# EAGLE design shieldAtmegaArianna_00 (EAGLE 6.5.0)
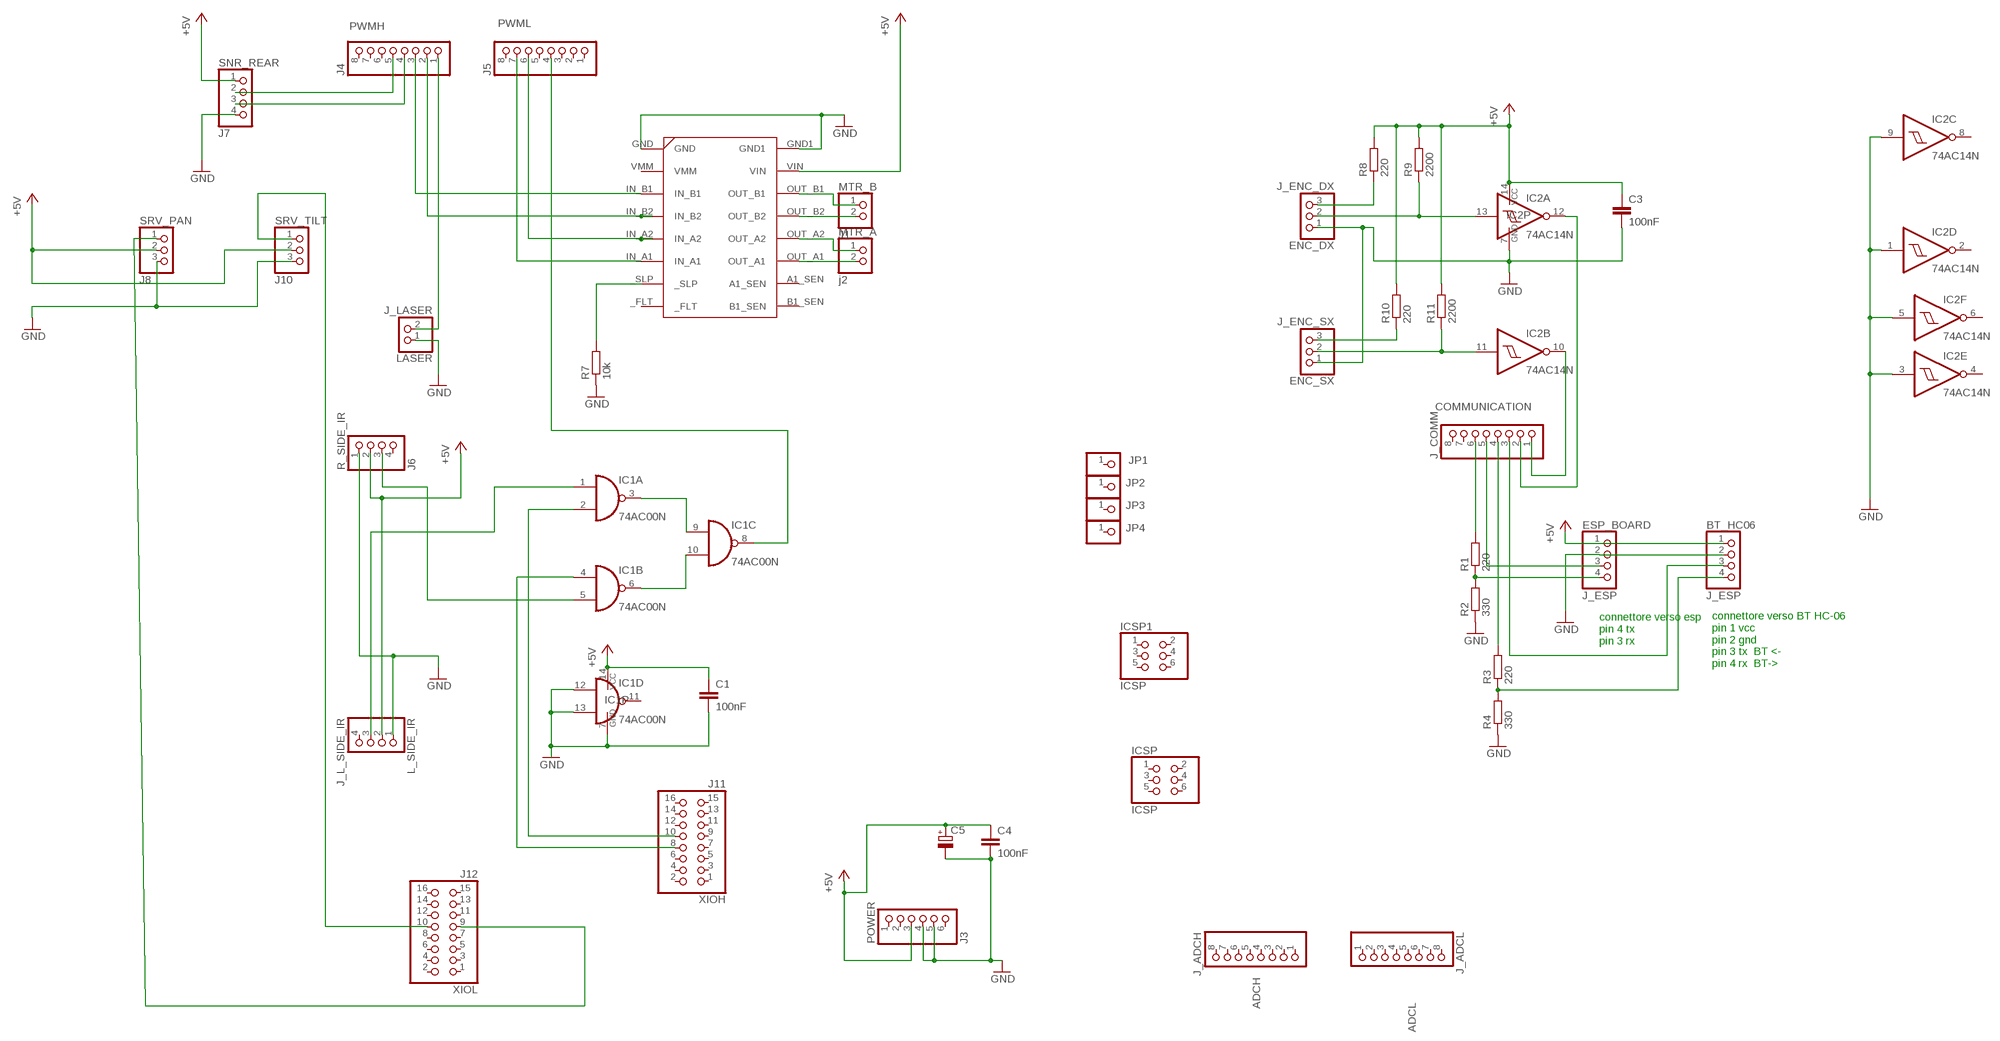
[diagram p0: schematic, sheet 1]

## Parts
ADCH  J_ADCH  PINHD-1X8  [1X08]
ADCL  J_ADCL  PINHD-1X8  [1X08]
BT_HC06  J_ESP  PINHD-1X4  [1X04]
C1  100nF  C-EU050-025X075  [C050-025X075]
C3  100nF  C-EU050-025X075  [C050-025X075]
C4  100nF  C-EU050-025X075  [C050-025X075]
C5  CPOL-EUE5-8.5  [E5-8,5]
COMMUNICATION  J_COMM  PINHD-1X8  [1X08]
ENC_DX  J_ENC_DX  PINHD-1X3  [1X03]
ENC_SX  J_ENC_SX  PINHD-1X3  [1X03]
ESP_BOARD  J_ESP  PINHD-1X4  [1X04]
IC1  74AC00N  [DIL14]
IC2  74AC14N  [DIL14]
ICSP  ICSP  PINHD-2X3  [2X03]
ICSP1  ICSP  PINHD-2X3  [2X03]
JP1  PINHD-1X1  [1X01]
JP2  PINHD-1X1  [1X01]
JP3  PINHD-1X1  [1X01]
JP4  PINHD-1X1  [1X01]
L_SIDE_IR  J_L_SIDE_IR  PINHD-1X4  [1X04]
LASER  J_LASER  PINHD-1X2  [1X02]
MTR_A  j2  PINHD-1X2  [1X02]
MTR_B  J1  PINHD-1X2  [1X02]
POWER  J3  PINHD-1X6  [1X06]
PWMH  J4  PINHD-1X8  [1X08]
PWML  J5  PINHD-1X8  [1X08]
R1  220  R-EU_0207/10  [0207/10]
R2  330  R-EU_0207/10  [0207/10]
R3  220  R-EU_0207/10  [0207/10]
R4  330  R-EU_0207/10  [0207/10]
R7  10k  R-EU_0207/10  [0207/10]
R8  220  R-EU_0207/10  [0207/10]
R9  2200  R-EU_0207/10  [0207/10]
R10  220  R-EU_0207/10  [0207/10]
R11  2200  R-EU_0207/10  [0207/10]
R_SIDE_IR  J6  PINHD-1X4  [1X04]
SNR_REAR  J7  PINHD-1X4  [1X04]
SRV_PAN  J8  PINHD-1X3  [1X03]
SRV_TILT  J10  PINHD-1X3  [1X03]
U$1  DRV8803  [8X5CARRIER]
XIOH  J11  PINHD-2X8  [2X08]
XIOL  J12  PINHD-2X8  [2X08]

## Nets
+5V [supply]: BT_HC06.1 C1.1 C3.1 C4.1 C5.+ ESP_BOARD.1 IC1.14(P:VCC) IC2.14(P:VCC) L_SIDE_IR.2 POWER.3 R8.2 R9.2 R10.2 R11.2 R_SIDE_IR.2 SNR_REAR.1 SRV_PAN.2 SRV_TILT.2 U$1.VIN
ECHO: PWMH.4 SNR_REAR.3
GND: BT_HC06.2 C1.2 C3.2 C4.2 C5.- ENC_DX.1 ENC_SX.1 ESP_BOARD.2 IC1.7(P:GND) IC1.12(D:I0) IC1.13(D:I1) IC2.1(D:I) IC2.3(E:I) IC2.5(F:I) IC2.7(P:GND) IC2.9(C:I) L_SIDE_IR.1 LASER.1 POWER.4 POWER.5 R2.1 R4.1 R7.1 R_SIDE_IR.1 SNR_REAR.4 SRV_PAN.3 SRV_TILT.3 U$1.GND U$1.GND1
N$1 [supply]: MTR_B.1 U$1.OUT_B1
N$2 [supply]: MTR_B.2 U$1.OUT_B2
N$3 [supply]: MTR_A.1 U$1.OUT_A2
N$4: SRV_TILT.1 XIOL.10
N$5: SRV_PAN.1 XIOL.9
N$6 [supply]: MTR_A.2 U$1.OUT_A1
N$7: PWML.7 U$1.IN_A1
N$8: PWML.6 U$1.IN_A2
N$9: PWMH.2 U$1.IN_B2
N$10: PWMH.3 U$1.IN_B1
N$11: ESP_BOARD.4 R1.1 R2.2
N$12: BT_HC06.4 R3.1 R4.2
N$14: COMMUNICATION.6 R1.2
N$15: COMMUNICATION.4 R3.2
N$16: COMMUNICATION.5 ESP_BOARD.3
N$17: BT_HC06.3 COMMUNICATION.3
N$19: IC1.3(A:O) IC1.9(C:I0)
N$20: IC1.6(B:O) IC1.10(C:I1)
N$21 [supply]: LASER.2 PWMH.1
N$22: IC1.2(A:I1) XIOH.10
N$23: IC1.5(B:I1) R_SIDE_IR.3
N$24: IC1.8(C:O) PWML.4
N$25: IC1.1(A:I0) L_SIDE_IR.3
N$26: IC1.4(B:I0) XIOH.8
N$27: R7.2 U$1._SLP
N$28: ENC_DX.3 R8.1
N$29: ENC_DX.2 IC2.13(A:I) R9.1
N$30: ENC_SX.3 R10.1
N$31: PWMH.5 SNR_REAR.2
N$32: ENC_SX.2 IC2.11(B:I) R11.1
N$33: COMMUNICATION.2 IC2.12(A:O)
N$35: COMMUNICATION.1 IC2.10(B:O)
Unconnected: ADCH.1 ADCH.2 ADCH.3 ADCH.4 ADCH.5 ADCH.6 ADCH.7 ADCH.8 ADCL.1 ADCL.2 ADCL.3 ADCL.4 ADCL.5 ADCL.6 ADCL.7 ADCL.8 COMMUNICATION.7 COMMUNICATION.8 IC1.11(D:O) IC2.2(D:O) IC2.4(E:O) IC2.6(F:O) IC2.8(C:O) ICSP1.1 ICSP1.2 ICSP1.3 ICSP1.4 ICSP1.5 ICSP1.6 ICSP.1 ICSP.2 ICSP.3 ICSP.4 ICSP.5 ICSP.6 JP1.1 JP2.1 JP3.1 JP4.1 L_SIDE_IR.4 POWER.1 POWER.2 POWER.6 PWMH.6 PWMH.7 PWMH.8 PWML.1 PWML.2 PWML.3 PWML.5 PWML.8 R_SIDE_IR.4 U$1._FLT U$1.A1_SEN U$1.B1_SEN U$1.VMM XIOH.1 XIOH.2 XIOH.3 XIOH.4 XIOH.5 XIOH.6 XIOH.7 XIOH.9 XIOH.11 XIOH.12 XIOH.13 XIOH.14 XIOH.15 XIOH.16 XIOL.1 XIOL.2 XIOL.3 XIOL.4 XIOL.5 XIOL.6 XIOL.7 XIOL.8 XIOL.11 XIOL.12 XIOL.13 XIOL.14 XIOL.15 XIOL.16

## Notes on the sheet
- connettore verso esp 
  pin 4 tx
  pin 3 rx
- connettore verso BT HC-06
  pin 1 vcc
  pin 2 gnd
  pin 3 tx  BT <-
  pin 4 rx  BT->

## Library data of the parts
ADCH ADCL COMMUNICATION PWMH PWML = pinhead:PINHD-1X8: PIN HEADER
BT_HC06 ESP_BOARD L_SIDE_IR R_SIDE_IR SNR_REAR = pinhead:PINHD-1X4: PIN HEADER
C1 C3 C4 = rcl:C-EU: CAPACITOR, European symbol
C5 = rcl:CPOL-EU: POLARIZED CAPACITOR, European symbol
ENC_DX ENC_SX SRV_PAN SRV_TILT = pinhead:PINHD-1X3: PIN HEADER
IC1 = 74xx-eu:74*00: Quad 2-input NAND gate
IC2 = 74xx-eu:74*14: Hex schmitt trigger INVERTER
ICSP ICSP1 = pinhead:PINHD-2X3: PIN HEADER
JP1-JP4 = pinhead:PINHD-1X1: PIN HEADER
LASER MTR_A MTR_B = pinhead:PINHD-1X2: PIN HEADER
POWER = pinhead:PINHD-1X6: PIN HEADER
R1-R4 R7-R11 = rcl:R-EU_: RESISTOR, European symbol
U$1 = arianna:DRV8803
XIOH XIOL = pinhead:PINHD-2X8: PIN HEADER

## Net classes
0 default: width 0.152 mm, drill 0.305 mm, clearance 0.152 mm
1 supply: width 0.61 mm, drill 0.305 mm, clearance 0.152 mm to class 0, clearance 0.152 mm

## Board
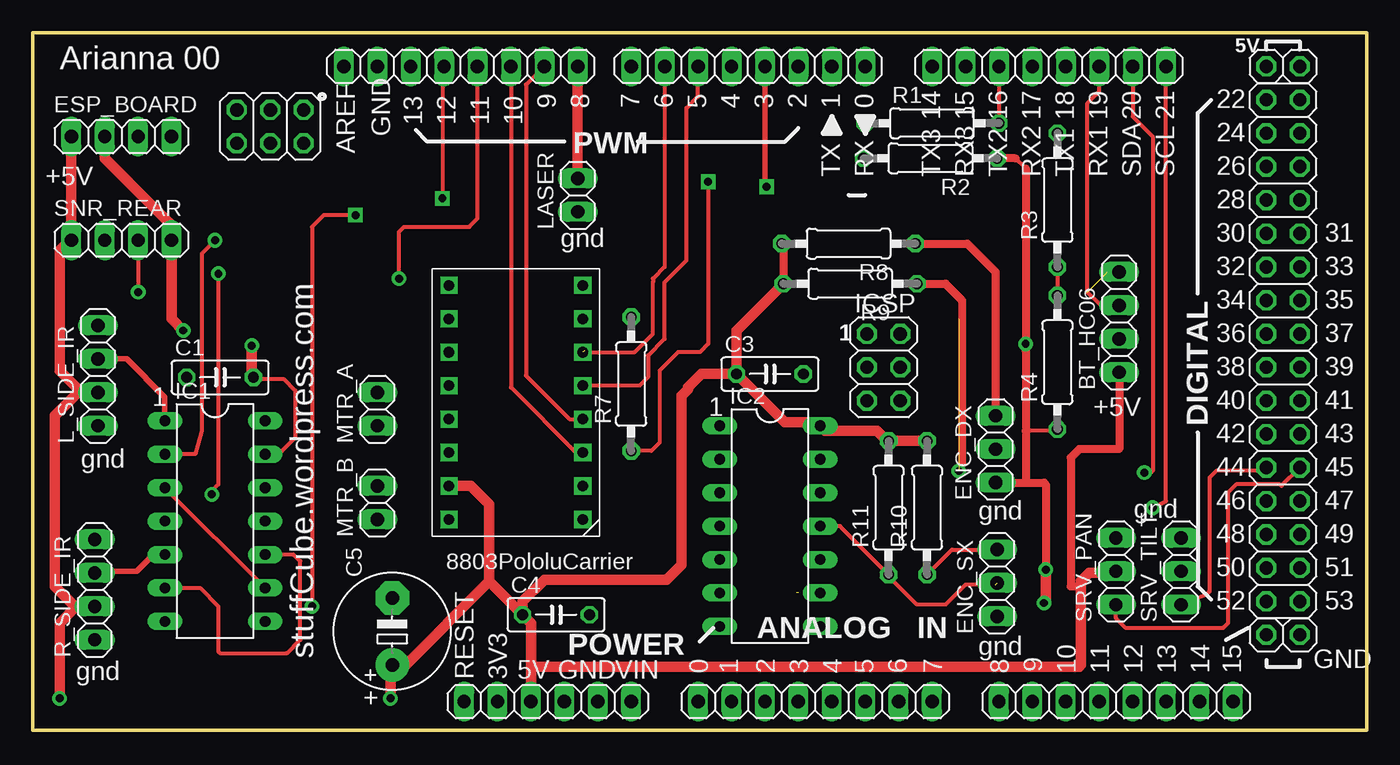
[diagram p1: board, top side]
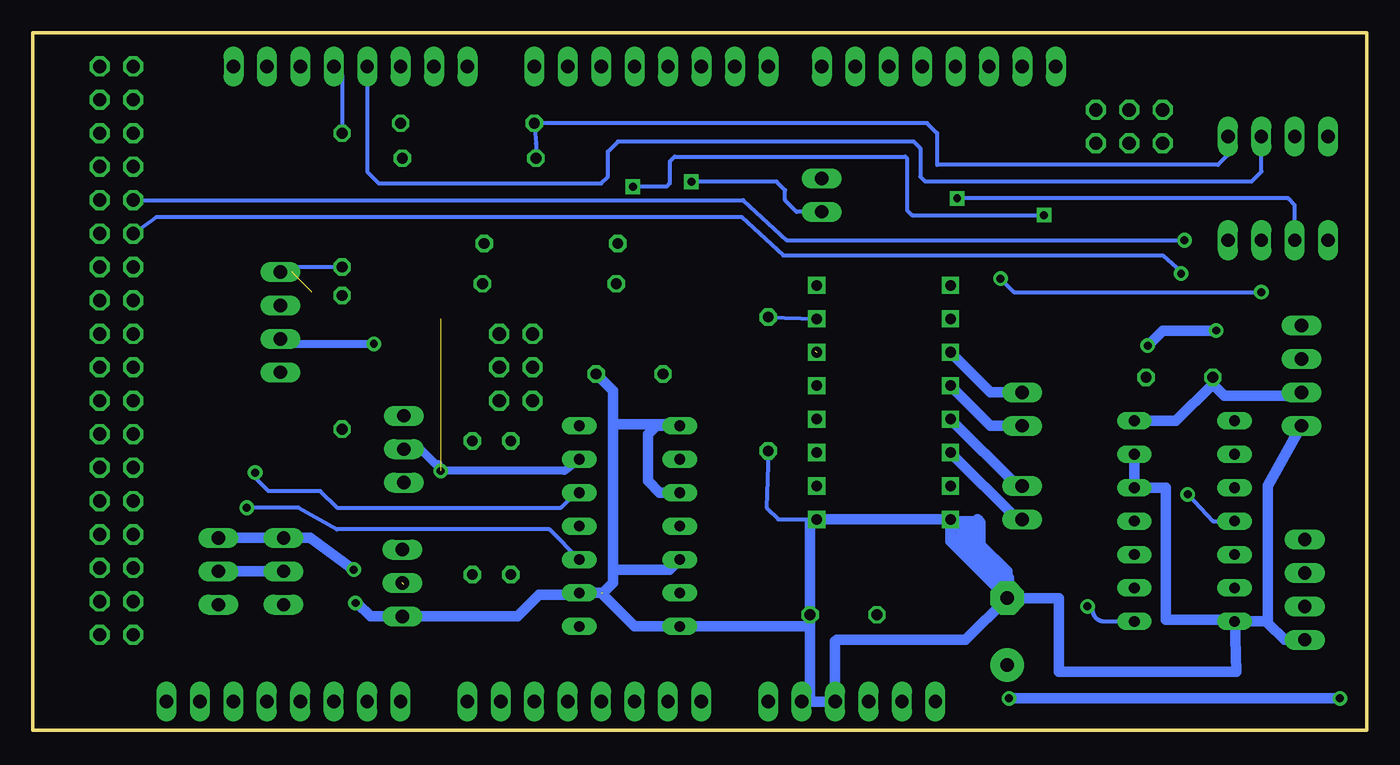
[diagram p2: board, bottom side, seen from below]

Size 101.35 x 52.96 mm. Coordinates in mm from the lower left corner, seen from the top.
Outline: 0,52.96 101.35,52.96 101.35,0 0,0 0,52.96
Copper layers (1*16): Top 0.035mm / dielectric 1.5mm / Bottom 0.035mm
Design rules "default": minimum track width 6mil, minimum drill 12mil, track to track 6mil, track to pad 6mil, pad to pad 6mil, via to via 6mil, smd to smd 6mil, copper to edge 40mil, drill to drill 12mil, minimum pad ring 10mil, minimum via ring 10mil, stop-mask expansion 2mil, vias tented up to drill 1mil, thermal gap 10mil

### Footprints (pad centres in the part's own frame; a part is rotated, then mirrored left to right if it is on the bottom)
1X08 = drill 1.016 long: 1 -8.89,0; 2 -6.35,0; 3 -3.81,0; 4 -1.27,0; 5 1.27,0; 6 3.81,0; 7 6.35,0; 8 8.89,0
1X04 = drill 1.016 long: 1 -3.81,0; 2 -1.27,0; 3 1.27,0; 4 3.81,0
C050-025X075 = drill 0.813 octagon: 1 -2.54,0; 2 2.54,0
E5-8,5 = drill 1.016 pad 2.54: + -2.54,0 | drill 1.016 pad 2.54 octagon: - 2.54,0
1X03 = drill 1.016 long: 1 -2.54,0; 2 0,0; 3 2.54,0
DIL14 = drill 0.813 long: 1 -7.62,-3.81; 2 -5.08,-3.81; 3 -2.54,-3.81; 4 0,-3.81; 5 2.54,-3.81; 6 5.08,-3.81; 7 7.62,-3.81; 8 7.62,3.81; 9 5.08,3.81; 10 2.54,3.81; 11 0,3.81; 12 -2.54,3.81; 13 -5.08,3.81; 14 -7.62,3.81
2X03 = drill 1.016 octagon: 1 -2.54,-1.27; 2 -2.54,1.27; 3 0,-1.27; 4 0,1.27; 5 2.54,-1.27; 6 2.54,1.27
1X01 = drill 1.016 octagon: 1 0,0
1X02 = drill 1.016 long: 1 -1.27,0; 2 1.27,0
1X06 = drill 1.016 long: 1 -6.35,0; 2 -3.81,0; 3 -1.27,0; 4 1.27,0; 5 3.81,0; 6 6.35,0
0207/10 = drill 0.813 octagon: 1 -5.08,0; 2 5.08,0
8X5CARRIER = drill 0.8 square: _FLT -5.08,-8.89; _SLP -5.08,-6.35; A1_SEN 5.08,-6.35; B1_SEN 5.08,-8.89; GND -5.08,8.89; GND1 5.08,8.89; IN_A1 -5.08,-3.81; IN_A2 -5.08,-1.27; IN_B1 -5.08,3.81; IN_B2 -5.08,1.27; OUT_A1 5.08,-3.81; OUT_A2 5.08,-1.27; OUT_B1 5.08,3.81; OUT_B2 5.08,1.27; VIN 5.08,6.35; VMM -5.08,6.35
2X08 = drill 1.016 octagon: 1 -8.89,-1.27; 2 -8.89,1.27; 3 -6.35,-1.27; 4 -6.35,1.27; 5 -3.81,-1.27; 6 -3.81,1.27; 7 -1.27,-1.27; 8 -1.27,1.27; 9 1.27,-1.27; 10 1.27,1.27; 11 3.81,-1.27; 12 3.81,1.27; 13 6.35,-1.27; 14 6.35,1.27; 15 8.89,-1.27; 16 8.89,1.27

### Placement (x,y rotation side)
ADCH  82.3,2.16 0 top
ADCL  59.44,2.16 0 top
BT_HC06  82.55,30.99 90 top
C1  14.22,26.8 0 top
C3  56.01,27.05 0 top
C4  39.75,8.76 0 top
C5  27.3,7.49 90 top
COMMUNICATION  77.22,50.42 180 top
ENC_DX  73.15,21.34 90 top
ENC_SX  73.28,11.18 90 top
ESP_BOARD  6.73,45.09 0 top
IC1  13.84,15.88 270 top
IC2  56.01,15.49 270 top
ICSP  64.64,27.56 270 top
ICSP1  18.03,45.85 180 top
JP1  93.73,50.42 0 top
JP2  96.27,50.42 0 top
JP3  93.73,7.24 0 top
JP4  96.27,7.24 0 top
L_SIDE_IR  4.95,26.92 90 top
LASER  41.4,40.64 90 top
MTR_A  26.16,24.38 90 top
MTR_B  26.16,17.27 90 top
POWER  39.12,2.16 0 top
PWMH  32.51,50.42 180 top
PWML  54.36,50.42 180 top
R1  68.33,46.1 0 top
R2  68.2,43.43 180 top
R3  77.85,40.26 90 top
R4  77.85,27.94 90 top
R7  45.47,26.29 90 top
R8  61.98,36.96 180 top
R9  62.1,33.91 180 top
R10  67.94,16.89 90 top
R11  65.02,16.89 90 top
R_SIDE_IR  4.7,10.67 90 top
SNR_REAR  6.73,37.21 0 top
SRV_PAN  82.3,12.06 90 top
SRV_TILT  87.25,12.06 90 top
U$1  36.7,24.89 180 top
XIOH  95,38.99 90 top
XIOL  95,18.67 90 top

### Tracks (layer width: path | path; a pad name or v marks a point on that pad's centre or on a via)
+5V  (via drill 0.6)
  Top 0.61: R8.2 57.02,36.83 R9.2 | BT_HC06.1 82.55,21.34 79.5,21.34 78.87,20.7 78.87,10.92 79.63,10.92
  Top 0.813: C5.+ 27.18,4.83 | C4.1 34.67,11.3 | 34.67,11.3 34.67,17.14 33.27,18.54 U$1.VIN | C3.1 50.8,27.05 49.78,26.04 49.78,25.91 49.28,25.4 49.28,12.57 48.13,11.43 38.86,11.43 37.21,9.78 C4.1 | 34.67,11.3 28.19,4.83 27.18,4.83 | C3.1 57.15,23.37 59.56,23.37 IC2.14 60.2,22.73 64.13,22.73 64.9,21.97 R11.2 R10.2 | R9.2 53.47,30.35 C3.1 | L_SIDE_IR.2 3.68,25.65 | 3.68,25.65 2.03,27.3 2.03,36.45 2.67,37.08 2.79,37.08 SNR_REAR.1 ESP_BOARD.1 | 3.68,25.65 3.43,25.65 1.65,23.88 1.65,10.92 3.17,9.4 R_SIDE_IR.2 3.3,9.4 2.03,8.13 v2.03,2.41 | POWER.3 37.85,4.83 | 37.85,4.83 37.85,8.13 C4.1 | 27.18,4.83 v27.18,2.41 | SRV_PAN.2 82.17,11.94 80.26,11.94 79.63,11.3 79.63,10.92 79.63,4.95 79.5,4.83 37.85,4.83
  Bottom 0.813: U$1.VIN 31.62,18.67 | v27.18,2.41 v2.03,2.41 | L_SIDE_IR.2 5.21,25.4 10.79,25.4 11.68,26.29 | 11.68,26.29 C1.1 | 11.68,26.29 14.48,23.5 IC1.14 | SRV_TILT.2 SRV_PAN.2
ECHO  (via drill 0.6)
  Top 0.305: PWMH.4 33.78,38.86 33.15,38.23 28.19,38.23 27.81,37.85 v27.81,34.29 | SNR_REAR.3 v8,33.27
  Bottom 0.305: v27.81,34.29 26.8,33.27 v8,33.27 7.87,33.27
GND  (via drill 0.6)  (1 unrouted)
  Top 0.305: v51.31,41.66 51.31,29.34 50.67,28.7 49.02,28.7 47.62,27.3 47.62,21.84 46.99,21.21 R7.1 | C1.2 16.89,26.67 19.05,26.67 19.94,25.78 19.94,22.23 18.67,20.95 IC1.13 | 76.83,18.8 76.96,18.67 | R4.1 77.72,22.73 75.44,22.73 | 75.44,42.67 74.68,43.43 | v75.44,29.34 75.44,28.83
  Top 0.61: ENC_DX.1 75.44,18.8 | 75.44,18.8 76.83,18.8 | 76.96,18.67 v76.96,12.19 | 75.44,42.67 v75.44,29.34 | 75.44,28.83 75.44,22.73 75.44,18.8 | 74.68,43.43 R2.1
  Top 0.813: ESP_BOARD.2 5.46,43.43 10.54,38.35 SNR_REAR.4 10.54,31.24 v11.43,30.35 | C1.2 16.64,26.92 v16.64,29.21 | v76.83,9.65 76.96,9.78 v76.96,12.19
  Bottom 0.305: R7.1 45.59,16.89 44.7,16 U$1.GND | LASER.1 43.31,39.37 44.2,40.26 44.2,41.02 44.83,41.66 v51.31,41.66 | BT_HC06.2 82.17,29.34
  Bottom 0.61: 82.17,29.34 v75.44,29.34
  Bottom 0.813: C4.2 42.29,2.16 POWER.5 POWER.4 40.39,6.73 40.26,6.86 30.48,6.86 C5.- | U$1.GND1 U$1.GND 41.78,15.75 42.29,15.75 42.29,7.87 IC2.7 55.63,7.87 58.17,10.41 IC2.9 59.94,10.29 62.87,10.29 64.52,8.64 ENC_SX.1 75.69,8.64 76.71,9.65 v76.83,9.65 | U$1.GND1 30.35,15.49 30.35,13.84 | 30.35,13.84 27.56,11.05 | 30.35,13.84 31.11,14.61 30.23,14.61 29.72,15.11 29.72,15.88 31.37,15.88 31.62,15.62 31.24,15.62 27.18,11.56 27.18,10.41 27.3,10.29 27.3,12.06 29.34,14.1 29.34,15.75 29.59,16 | IC1.13 IC1.12 15.24,18.41 15.24,8.38 10.03,8.38 IC1.7 | IC1.7 9.91,4.44 23.37,4.44 23.37,10.03 C5.- | 58.04,10.41 57.28,11.18 57.28,12.19 | C3.2 57.28,25.78 57.28,23.24 | 57.28,23.24 57.28,12.19 | IC2.1 52.32,23.24 | 52.32,23.24 57.28,23.24 | C5.- 31.62,14.35 U$1.GND1 | IC2.5 52.96,12.19 57.28,12.19 | 52.32,23.24 52.45,23.11 53.98,23.11 54.61,22.48 54.61,18.92 53.72,18.03 IC2.3 | R_SIDE_IR.1 6.22,6.86 7.49,8.13 | 7.49,8.13 7.62,8.25 IC1.7 | L_SIDE_IR.1 7.49,18.54 7.49,8.13 | v16.64,29.21 15.49,30.35 v11.43,30.35 | SRV_TILT.3 SRV_PAN.3 80.26,14.61 v76.96,12.19
N$1
  Bottom 0.813: U$1.OUT_B1 26.54,16 MTR_B.1
N$2
  Bottom 0.813: U$1.OUT_B2 26.54,18.54 MTR_B.2
N$3
  Bottom 0.813: U$1.OUT_A2 28.57,23.11 MTR_A.1
N$4
  Top 0.305: XIOL.10 93.47,19.68 89.92,19.68 89.41,19.18 89.41,10.54 89.15,10.29 SRV_TILT.1
N$5
  Top 0.305: XIOL.9 94.87,18.54 94.74,18.67 91.44,18.67 90.8,18.03 90.8,8.13 90.42,7.75 83.06,7.75 82.3,8.51 SRV_PAN.1
N$6
  Bottom 0.813: U$1.OUT_A1 28.57,25.65 MTR_A.2
N$7  (1 unrouted)
  Top 0.305: 41.91,28.83 42.04,28.7 45.72,28.7 47.12,30.1 47.12,31.5 47.12,34.04 47.12,34.29 48.01,35.18 PWML.7
N$8
  Top 0.305: U$1.IN_A2 46.1,26.16 46.74,26.8 46.74,28.45 48.01,29.72 48.01,34.04 49.66,35.69 49.66,47.24 50.55,48.13 PWML.6
N$9
  Top 0.305: PWMH.2 37.47,49.02 37.47,26.92 40.77,23.62 U$1.IN_B2
N$10
  Top 0.305: PWMH.3 36.32,26.04 41.28,21.08 U$1.IN_B1
N$11
  Bottom 0.305: R2.2 63.12,44.58 R1.1 33.4,46.1 32.64,45.34 32.64,42.93 11.3,42.93 10.54,43.69 ESP_BOARD.4
N$12
  Top 0.305: R3.1 R4.2
  Bottom 0.305: BT_HC06.4 82.17,35.18 R3.1
N$14
  Top 0.305: COMMUNICATION.6 R1.2
N$15
  Bottom 0.305: COMMUNICATION.4 77.85,49.78 R3.2
N$16
  Bottom 0.305: COMMUNICATION.5 75.95,42.42 75.06,41.53 58.17,41.53 57.66,42.04 57.66,43.94 56.9,44.7 34.42,44.7 33.91,44.2 33.91,42.04 33.53,41.66 8.76,41.66 8,42.42 ESP_BOARD.3
N$17  (2 unrouted)
  Top 0.305: BT_HC06.3 81.15,32.26 80.14,33.27 80.14,47.62 81.03,48.51 COMMUNICATION.3
N$19
  Top 0.305: IC1.3 IC1.9
N$20
  Top 0.305: IC1.6 12.7,10.79 14.1,9.4 14.1,5.97 14.22,5.84 19.3,5.84 20.32,6.86 20.32,12.83 19.81,13.33 IC1.10
N$21
  Top 0.813: PWMH.1 LASER.2
N$22  (via drill 0.6)
  Top 0.305: v13.84,37.21 12.83,36.2 12.83,22.73 12.32,20.95 IC1.2
  Bottom 0.305: XIOH.10 47.37,40.26 44.07,37.21 v13.84,37.21
N$23
  Top 0.406: R_SIDE_IR.3 4.83,12.06 7.87,12.06 9.14,13.33 IC1.5
N$24  (via drill 0.6)
  Top 0.305: v21.21,9.4 21.21,38.23 22.1,39.12 v24.51,39.12
  Top 0.406: PWML.4 55.63,41.4 v55.75,41.27
  Bottom 0.305: v24.51,39.12 34.54,39.12 34.93,39.5 34.93,43.43 35.05,43.56 52.58,43.56 52.96,43.18 52.96,41.53 53.21,41.27 v55.75,41.27 | v21.21,9.4 arc-90 20.95,9.14 20.83,9.14 arc-90 19.94,8.25 IC1.8
N$25
  Top 0.406: L_SIDE_IR.3 7.11,28.19 10.03,25.27 IC1.1
N$26  (via drill 0.6)
  Top 0.305: v14.1,34.67 14.1,18.67 13.59,18.16 v13.59,17.91
  Bottom 0.305: XIOH.8 91.95,38.99 47.5,38.99 44.32,36.07 15.49,36.07 14.1,34.8 v14.1,34.67 | v13.59,17.91 11.68,15.88 IC1.4
N$27
  Bottom 0.305: R7.2 U$1._SLP
N$28
  Top 0.61: R8.1 70.99,36.96 73.15,34.8 ENC_DX.3
N$29  (via drill 0.6)  (2 unrouted)
  Top 0.61: R9.1 69.34,33.91 70.61,32.64 70.61,20.19
  Bottom 0.61: IC2.13 60.96,19.68 v70.36,19.68 70.48,20.19 70.74,20.19 71.88,21.34 ENC_DX.2
N$30
  Top 0.305: R10.1 69.85,13.72 ENC_SX.3
N$31  (via drill 0.6)
  Top 0.305: PWMH.5 31.37,50.29 31.11,50.04 v31.11,40.39
  Bottom 0.305: v31.11,40.39 5.97,40.39 5.46,39.88 SNR_REAR.2
N$32  (1 unrouted)
  Top 0.305: 73.15,11.05 70.87,11.05 69.34,9.53 67.18,9.53 65.02,11.68 R11.1 61.34,15.49 IC2.11
N$33  (via drill 0.6)
  Top 0.305: COMMUNICATION.2 83.57,46.61 85.09,45.09 85.09,19.68 84.96,19.56 v84.45,19.56
  Bottom 0.305: IC2.12 60.07,18.03 61.21,16.89 78.23,16.89 79.5,18.16 83.44,18.16 84.45,19.18 v84.45,19.56
N$35  (via drill 0.6)
  Top 0.305: v85.09,16.89 86.11,17.4 COMMUNICATION.1
  Bottom 0.305: IC2.10 62.1,15.24 78.23,15.24 81.15,16.89 v85.09,16.89

### Text on the board
tPlace: 9 | 8 | 7 | 6 | 5 | 4 | 3 | 2 | 1 | 0 | 22 | 14 | 15 | 16 | 17 | 18 | 19 | 20 | 21 | 13 | 12 | 11 | 10 | 24 | 26 | 28 | 30 | 31 | 32 | 33 | 34 | 35 | 36 | 37 | 38 | 39 | 40 | 41 | 42 | 43 | 44 | 45 | 46 | 47 | 48 | 49 | 50 | 51 | 52 | 53 | 0 | 1 | 2 | 3 | 4 | 5 | 6 | 7 | 8 | 9 | 10 | 11 | 12 | 13 | 14 | 15
tNames: 5V | Arianna 00 | GND | AREF | PWM | +5V | TX | RX | TX3 | RX3 | TX2 | RX2 | TX1 | RX1 | SDA | SCL | gnd | 1 | 1 | 1 | +5V | DIGITAL | gnd | gnd | gnd | ANALOG IN | gnd | gnd | stuffCube.wordpress.com | GND | + | RESET | 3V3 | 5V | GND | VIN
ReferenceLC: L | TX | RX | PC1 | PC2